# EAGLE design cbm_usb_v1.1a (EAGLE 6.4)

## Sheet 1 of 3
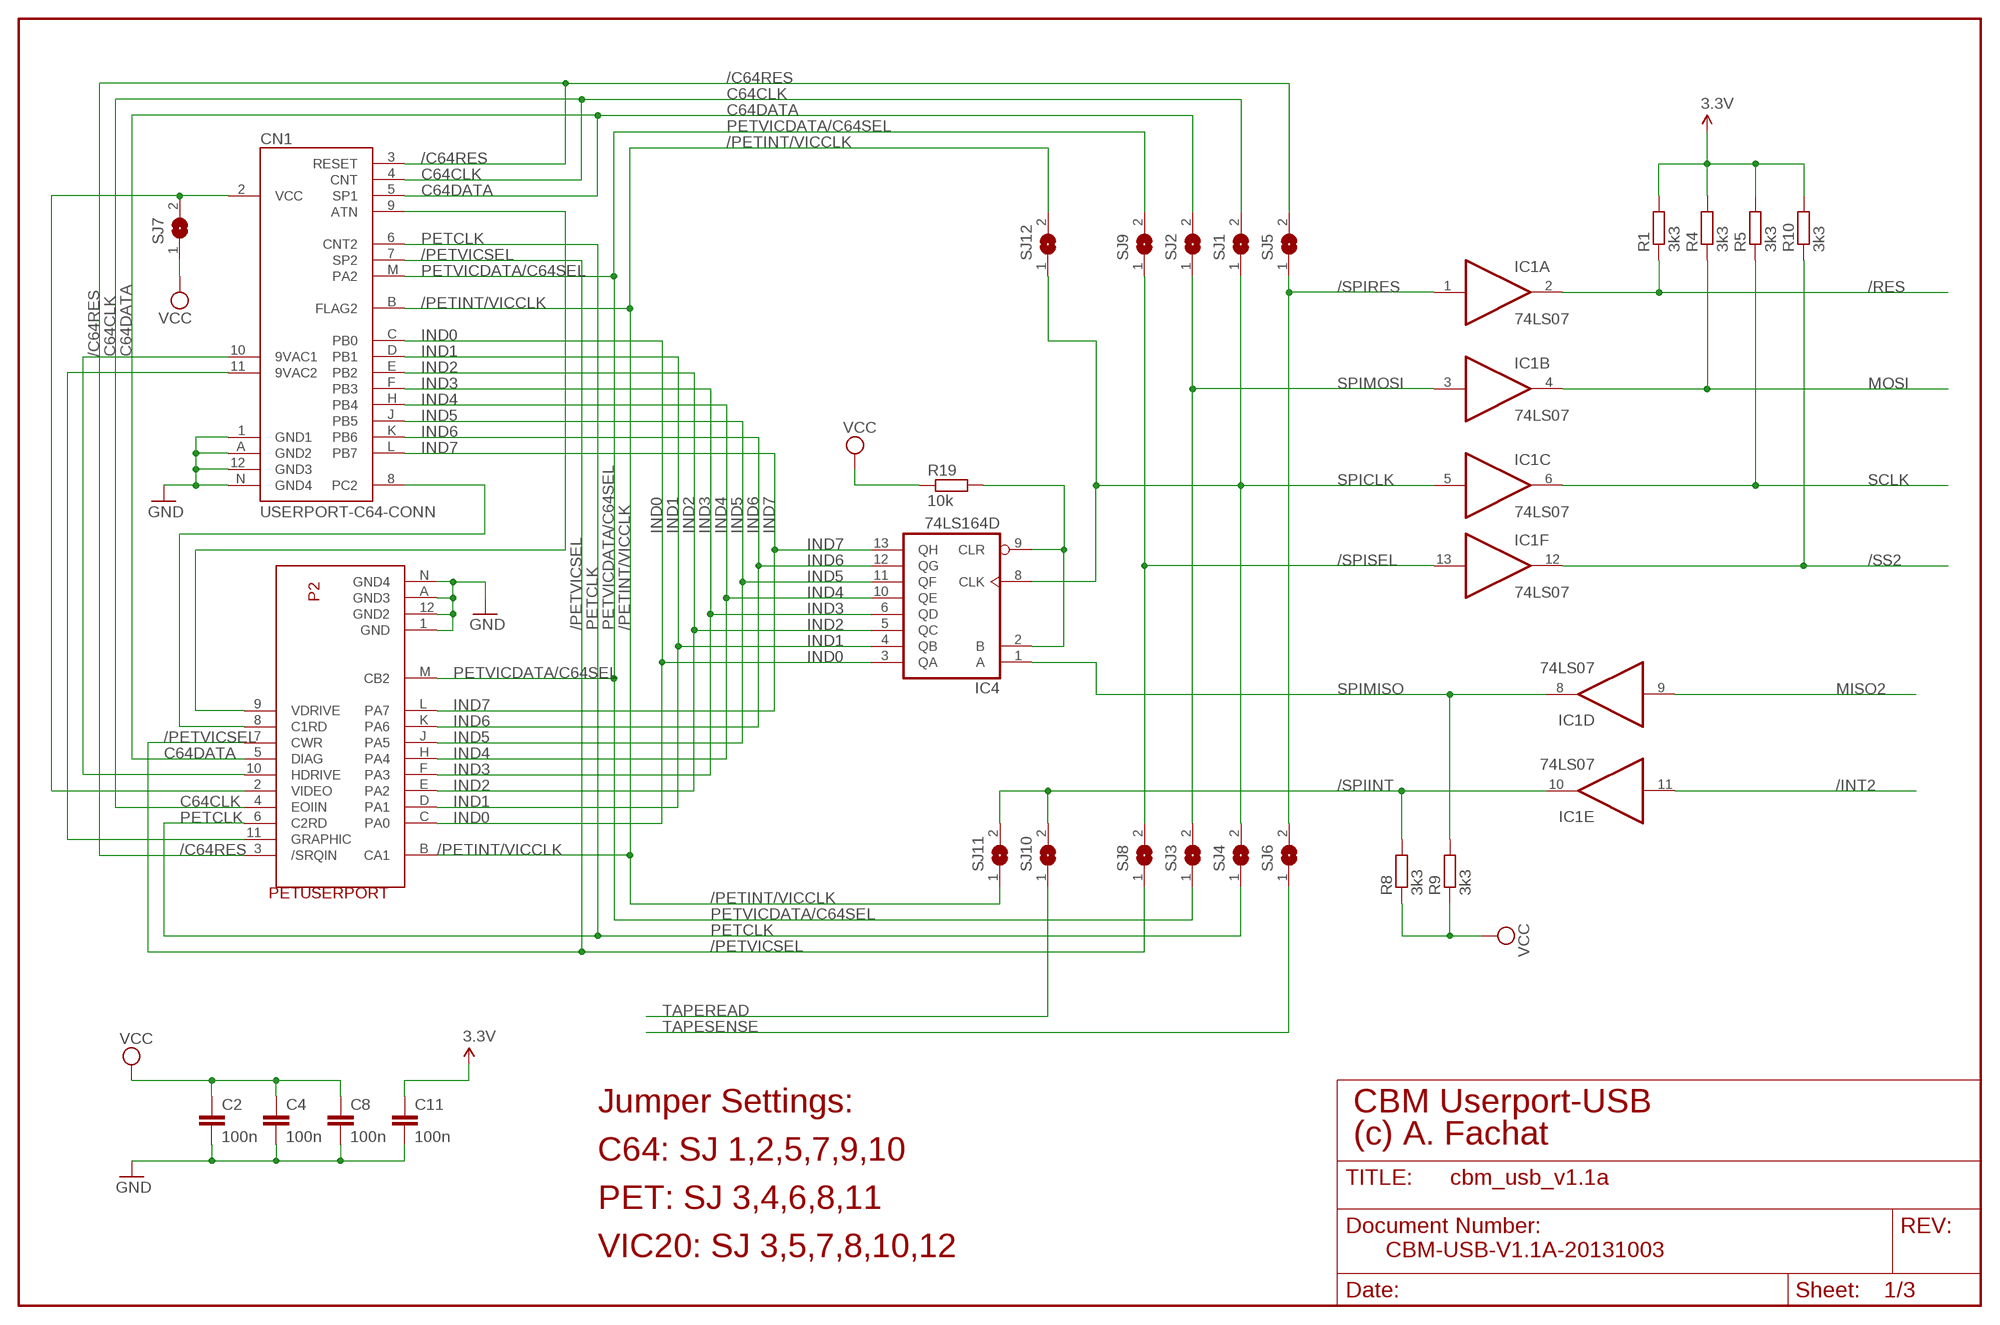
[diagram p0: schematic, sheet 1]

### Parts
C2  100n  C-EU050-025X075  [C050-025X075]
C4  100n  C-EU050-025X075  [C050-025X075]
C8  100n  C-EU050-025X075  [C050-025X075]
C11  100n  C-EU050-025X075  [C050-025X075]
CN1  USERPORT-C64-CONN  [UPS24CONN]
IC1  74LS07  74LS07D  [SO14]
IC4  74LS164D  [SO14]
P2  PETUSERPORT  [FLAT24]
R1  3k3  R-EU_0204/7  [0204/7]
R4  3k3  R-EU_0204/7  [0204/7]
R5  3k3  R-EU_0204/7  [0204/7]
R8  3k3  R-EU_0204/7  [0204/7]
R9  3k3  R-EU_0204/7  [0204/7]
R10  3k3  R-EU_0204/7  [0204/7]
R19  10k  R-EU_0204/7  [0204/7]
SJ1  SJW  [SJW]
SJ2  SJW  [SJW]
SJ3  SJW  [SJW]
SJ4  SJW  [SJW]
SJ5  SJW  [SJW]
SJ6  SJW  [SJW]
SJ7  SJW  [SJW]
SJ8  SJW  [SJW]
SJ9  SJW  [SJW]
SJ10  SJW  [SJW]
SJ11  SJW  [SJW]
SJ12  SJW  [SJW]

### Nets
3.3V: C11.1 R1.2 R4.2 R5.2 R10.2 ; also sheet 2,3
/C64RES: CN1.3(RESET) P2.3(/SRQIN) SJ5.2
/INT2: IC1.11(E:I) ; also sheet 2
/PETINT/VICCLK: CN1.B(FLAG2) P2.B(CA1) SJ11.1 SJ12.2
/PETVICSEL: CN1.7(SP2) P2.7(CWR) SJ8.1
/RES: IC1.2(A:O) R1.1 ; also sheet 2
/SPIINT: IC1.10(E:O) R8.2 SJ10.2 SJ11.2
/SPIRES: IC1.1(A:I) SJ5.1 SJ6.2
/SPISEL: IC1.13(F:I) SJ8.2 SJ9.1
/SS2: IC1.12(F:O) R10.1 ; also sheet 2
C64CLK: CN1.4(CNT) P2.4(EOIIN) SJ1.2
C64DATA: CN1.5(SP1) P2.5(DIAG) SJ2.2
GND: C2.2 C4.2 C8.2 C11.2 CN1.1(GND1) CN1.12(GND3) CN1.A(GND2) CN1.N(GND4) P2.1(GND) P2.12(GND2) P2.A(GND3) P2.N(GND4) ; also sheet 2,3
IND0: CN1.C(PB0) IC4.3(QA) P2.C(PA0)
IND1: CN1.D(PB1) IC4.4(QB) P2.D(PA1)
IND2: CN1.E(PB2) IC4.5(QC) P2.E(PA2)
IND3: CN1.F(PB3) IC4.6(QD) P2.F(PA3)
IND4: CN1.H(PB4) IC4.10(QE) P2.H(PA4)
IND5: CN1.J(PB5) IC4.11(QF) P2.J(PA5)
IND6: CN1.K(PB6) IC4.12(QG) P2.K(PA6)
IND7: CN1.L(PB7) IC4.13(QH) P2.L(PA7)
MISO2: IC1.9(D:I) ; also sheet 2
MOSI: IC1.4(B:O) R4.1 ; also sheet 2
N$1: CN1.10(9VAC1) P2.10(HDRIVE)
N$2: CN1.11(9VAC2) P2.11(GRAPHIC)
N$5: CN1.2(VCC) P2.2(VIDEO) SJ7.2
N$6: CN1.8(PC2) P2.8(C1RD)
N$7: CN1.9(ATN) P2.9(VDRIVE)
N$37: IC4.2(B) IC4.9(CLR) R19.2
PETCLK: CN1.6(CNT2) P2.6(C2RD) SJ4.1
PETVICDATA/C64SEL: CN1.M(PA2) P2.M(CB2) SJ3.1 SJ9.2
SCLK: IC1.6(C:O) R5.1 ; also sheet 2
SPICLK: IC1.5(C:I) IC4.8(CLK) SJ1.1 SJ4.2 SJ12.1
SPIMISO: IC1.8(D:O) IC4.1(A) R9.2
SPIMOSI: IC1.3(B:I) SJ2.1 SJ3.2
TAPEREAD: SJ10.1 ; also sheet 3
TAPESENSE: SJ6.1 ; also sheet 3
VCC: C2.1 C4.1 C8.1 R8.1 R9.1 R19.1 SJ7.1 ; also sheet 2,3

### Notes on the sheet
- Jumper Settings: | CBM Userport-USB
- (c) A. Fachat
- C64: SJ 1,2,5,7,9,10
- PET: SJ 3,4,6,8,11
- VIC20: SJ 3,5,7,8,10,12 | CBM-USB-V1.1A-20131003

## Sheet 2 of 3
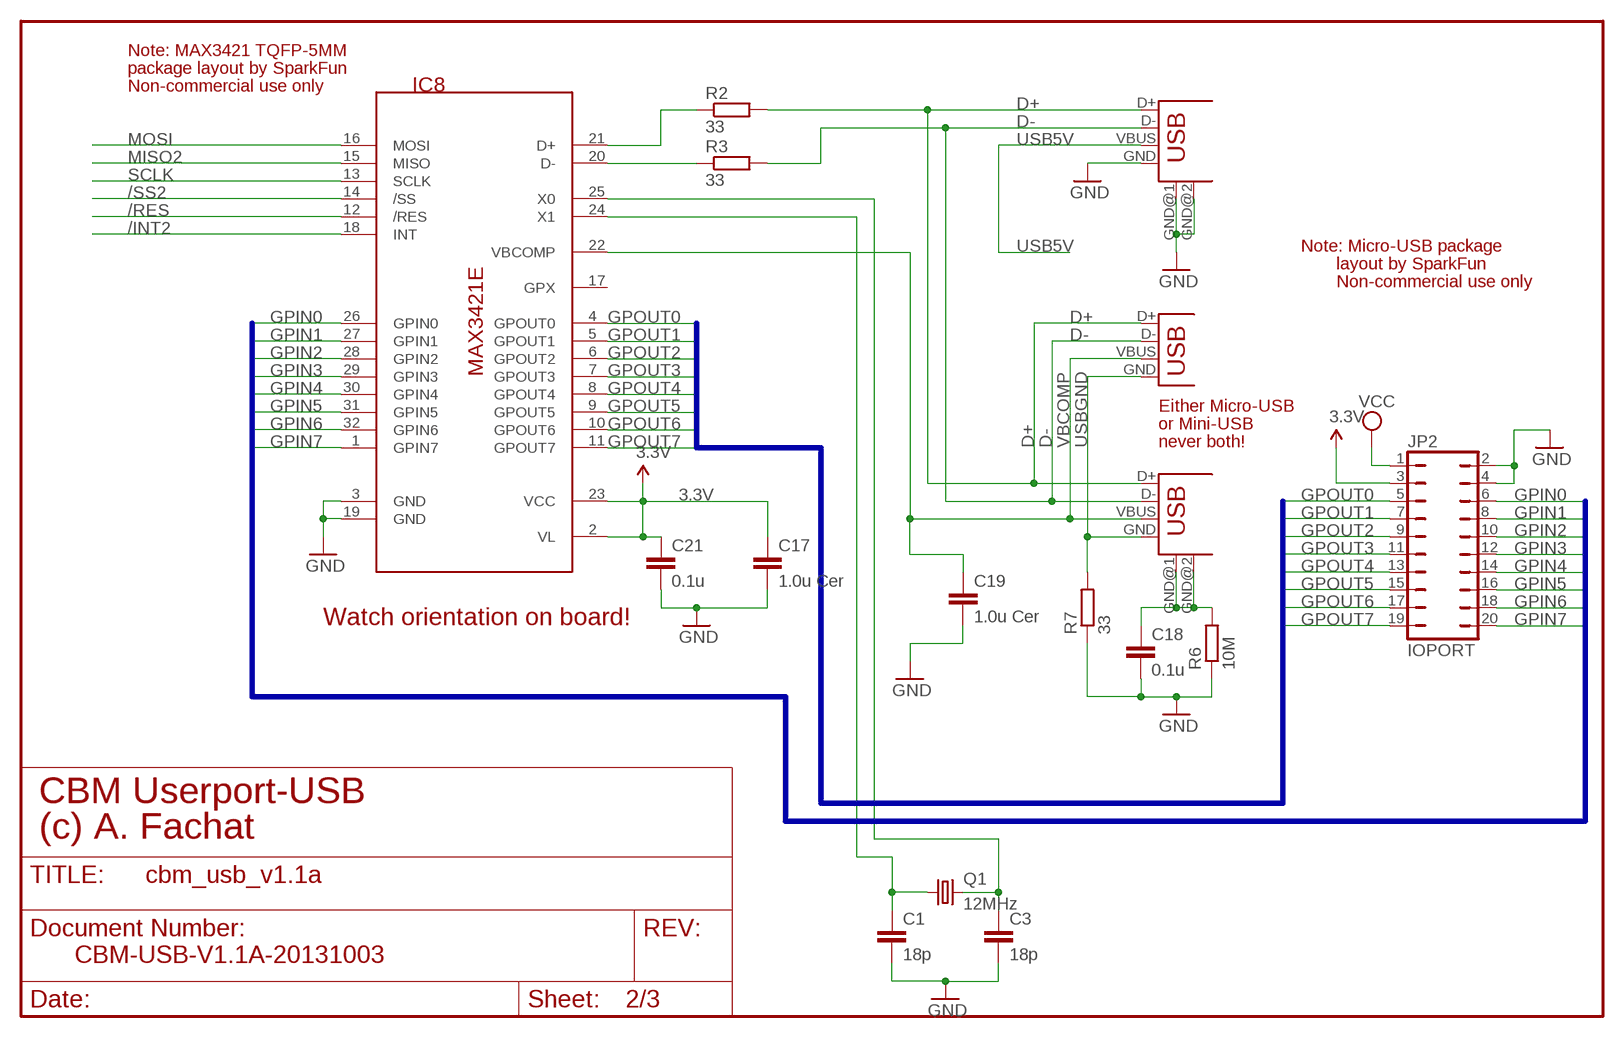
[diagram p1: schematic, sheet 2]

### Parts
C1  18p  C-EU050-025X075  [C050-025X075]
C3  18p  C-EU050-025X075  [C050-025X075]
C17  1.0u Cer  C-EU050-024X044  [C050-024X044]
C18  0.1u  C-EU050-025X075  [C050-025X075]
C19  1.0u Cer  C-EU050-024X044  [C050-024X044]
C21  0.1u  C-EU050-025X075  [C050-025X075]
IC8  MAX3421E  [TQFP32-5MM]
JP2  IOPORT  JP10Q  [JP10Q]
Q1  12MHz  CRYSTALHC49U70  [HC49U70]
R2  33  R-EU_0204/7  [0204/7]
R3  33  R-EU_0204/7  [0204/7]
R6  10M  R-EU_0204/7  [0204/7]
R7  33  R-EU_0204/7  [0204/7]
USB1  USB-A-H  [USB-A-H]
USB2  USB-MB-H  [USB-MB-H]
X1  USB-MICROB  [USB-MICROB]

### Nets
3.3V: C17.1 C21.1 IC8.2(VL) IC8.23(VCC) JP2.3 ; also sheet 1,3
12MHZ: C1.1 IC8.24(X1) Q1.1
/INT2: IC8.18(INT) ; also sheet 1
/RES: IC8.12(/RES) ; also sheet 1
/SS2: IC8.14(/SS) ; also sheet 1
D+: R2.2 USB1.D+ USB2.D+ X1.D+
D-: R3.2 USB1.D- USB2.D- X1.D-
GND: C1.2 C3.2 C17.2 C18.2 C19.2 C21.2 IC8.3(GND) IC8.19(GND) JP2.2 JP2.4 R6.1 R7.1 USB1.GND USB1.GND@1(GND) USB1.GND@2(GND) ; also sheet 1,3
GPIN0: IC8.26(GPIN0) JP2.6
GPIN1: IC8.27(GPIN1) JP2.8
GPIN2: IC8.28(GPIN2) JP2.10
GPIN3: IC8.29(GPIN3) JP2.12
GPIN4: IC8.30(GPIN4) JP2.14
GPIN5: IC8.31(GPIN5) JP2.16
GPIN6: IC8.32(GPIN6) JP2.18
GPIN7: IC8.1(GPIN7) JP2.20
GPOUT0: IC8.4(GPOUT0) JP2.5
GPOUT1: IC8.5(GPOUT1) JP2.7
GPOUT2: IC8.6(GPOUT2) JP2.9
GPOUT3: IC8.7(GPOUT3) JP2.11
GPOUT4: IC8.8(GPOUT4) JP2.13
GPOUT5: IC8.9(GPOUT5) JP2.15
GPOUT6: IC8.10(GPOUT6) JP2.17
GPOUT7: IC8.11(GPOUT7) JP2.19
MISO2: IC8.15(MISO) ; also sheet 1
MOSI: IC8.16(MOSI) ; also sheet 1
N$3: IC8.20(D-) R3.1
N$4: IC8.21(D+) R2.1
N$11: C3.1 IC8.25(X0) Q1.2
N$16: C18.1 R6.2 USB2.GND@1(GND) USB2.GND@2(GND)
SCLK: IC8.13(SCLK) ; also sheet 1
USB5V: USB1.VBUS ; also sheet 3
USBGND: R7.2 USB2.GND X1.GND
VBCOMP: C19.1 IC8.22(VBCOMP) USB2.VBUS X1.VBUS
VCC: JP2.1 ; also sheet 1,3
Unconnected: IC8.17(GPX)

### Buses
GPIN[0..7]
GPOUT[0..7]

### Notes on the sheet
- Note: MAX3421 TQFP-5MM
- package layout by SparkFun
- Non-commercial use only
- Note: Micro-USB package
- layout by SparkFun
- Non-commercial use only
- Either Micro-USB
- or Mini-USB
- never both!
- Watch orientation on board!
- CBM Userport-USB
- (c) A. Fachat
- CBM-USB-V1.1A-20131003

## Sheet 3 of 3
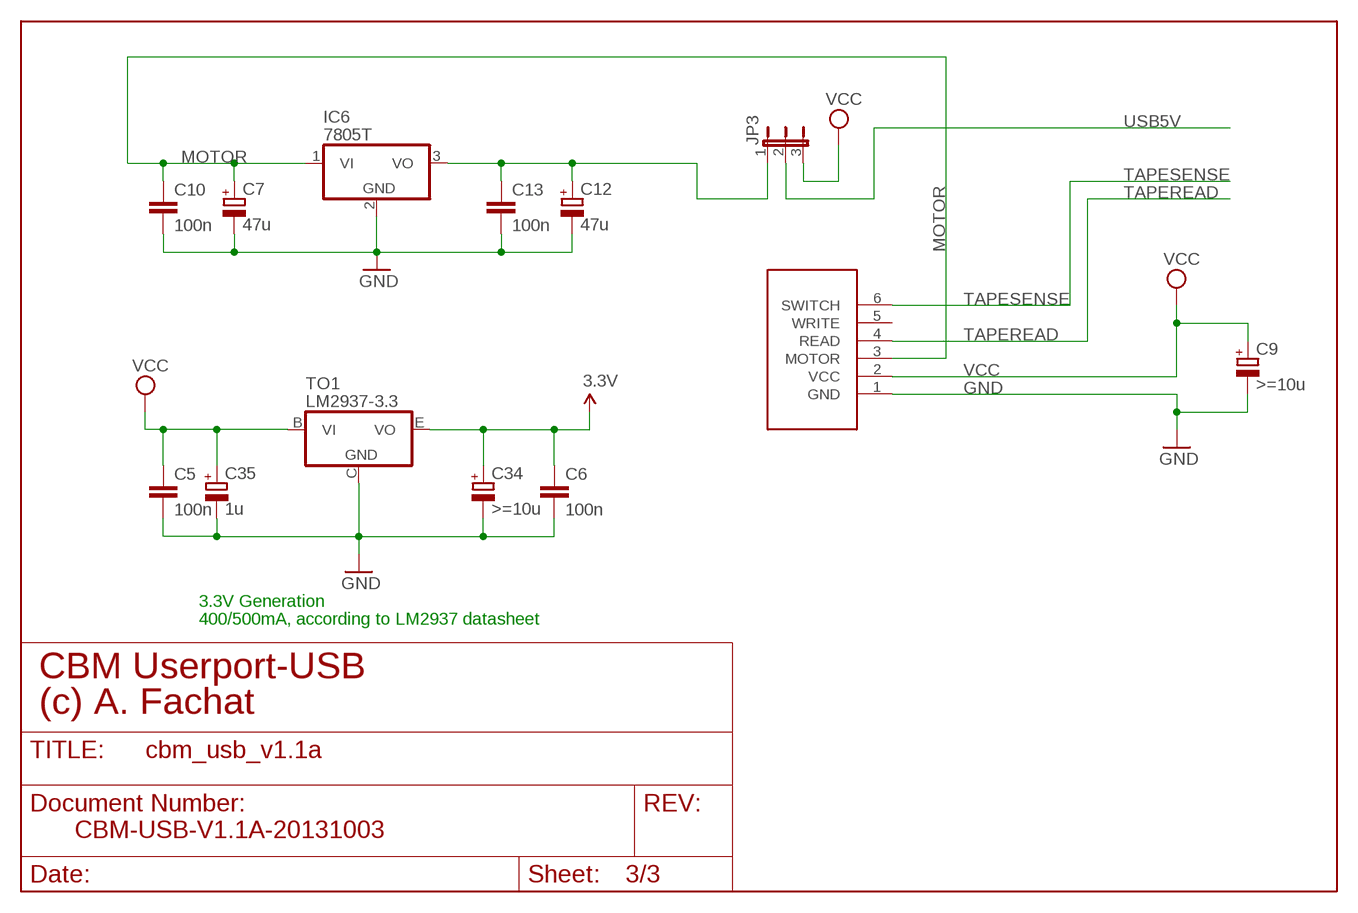
[diagram p2: schematic, sheet 3]

### Parts
C5  100n  C-EU050-025X075  [C050-025X075]
C6  100n  C-EU050-025X075  [C050-025X075]
C7  47u  CPOL-EUE3.5-8  [E3,5-8]
C9  >=10u  CPOL-EUE5-10.5  [E5-10,5]
C10  100n  C-EU050-030X075  [C050-030X075]
C12  47u  CPOL-EUE3.5-8  [E3,5-8]
C13  100n  C-EU050-030X075  [C050-030X075]
C34  >=10u  CPOL-EUE5-8.5  [E5-8,5]
C35  1u  CPOL-EUE5-8.5  [E5-8,5]
IC6  7805T  [TO220H]
JP3  JP2E  [JP2]
P3  CBMTAPE  [JP6]
TO1  LM2937-3.3  LM2937  [TO220H]

### Nets
3.3V: C6.1 C34.+ TO1.E(VO) ; also sheet 1,2
GND: C5.2 C6.2 C7.- C9.- C10.2 C12.- C13.2 C34.- C35.- IC6.2(GND) P3.1(GND) TO1.C(GND) ; also sheet 1,2
MOTOR: C7.+ C10.1 IC6.1(VI) P3.3(MOTOR)
N$8: C12.+ C13.1 IC6.3(VO) JP3.1
TAPEREAD: P3.4(READ) ; also sheet 1
TAPESENSE: P3.6(SWITCH) ; also sheet 1
USB5V: JP3.2 ; also sheet 2
VCC: C5.1 C9.+ C35.+ JP3.3 P3.2(VCC) TO1.B(VI) ; also sheet 1,2
Unconnected: P3.5(WRITE)

### Notes on the sheet
- 3.3V Generation
- 400/500mA, according to LM2937 datasheet
- CBM Userport-USB
- (c) A. Fachat
- CBM-USB-V1.1A-20131003

## Power pins joined to a net without a drawn wire
GND: IC1.7(P:GND) IC4.7(GND)
VCC: IC1.14(P:VCC) IC4.14(VCC)

## Library data of the parts
C1-C6 C8 C10 C11 C13 C17-C19 C21 = rcl:C-EU: CAPACITOR, European symbol
C7 C9 C12 C34 C35 = rcl:CPOL-EU: POLARIZED CAPACITOR, European symbol
CN1 = 0RB_Commodore:USERPORT-C64-CONN
IC1 = 74xx-eu:74*07: Hex BUFFER, open collector high-voltage output
IC4 = 74xx-eu:74*164: 8-bit parallel out SHIFT REGISTER
IC6 = linear:78*: Positive VOLTAGE REGULATOR Source: http://cache.national.com/ds/LM/LM78L05.pdf http://www.fairchildsemi.com/ds/LM/LM7805.pdf
IC8 = csa:MAX3421E
JP2 = jumper:JP10Q: JUMPER
JP3 = jumper:JP2E: JUMPER
P2 = csa:PETUSERPORT
P3 = csa:CBMTAPE
Q1 = crystal:CRYSTAL: CRYSTAL; OC_FARNELL: unknown; OC_NEWARK: unknown
R1-R10 R19 = rcl:R-EU_: RESISTOR, European symbol
SJ1-SJ12 = jumper:SJ: SMD solder JUMPER
TO1 = csa:LM2937
USB1 USB2 = con-usb-2:USB: USB Connectors USB-B-PTH is fully proven SKU : PRT-00139 USB-miniB is fully proven SKU : PRT-00587 USB-A-PCB is untested. USB-A-H is throughly reviewed, but untested. Spark Fun Electronics SKU : PRT-00437 USB-B-SMT is throughly reviewed, but untested. Needs silkscreen touching up. USB-A-S has not been used/tested USB-MB-H has not been used/tested
X1 = SparkFun:USB: USB Connectors USB-B-PTH is fully proven SKU : PRT-00139 USB-miniB is fully proven SKU : PRT-00587 USB-A-PCB is untested. USB-A-H is throughly reviewed, but untested. Spark Fun Electronics SKU : PRT-00437 USB-B-SMT is throughly reviewed, but untested. Needs silkscreen touching up. USB-A-S has not been used/tested USB-MB-H has not been used/tested

## Board
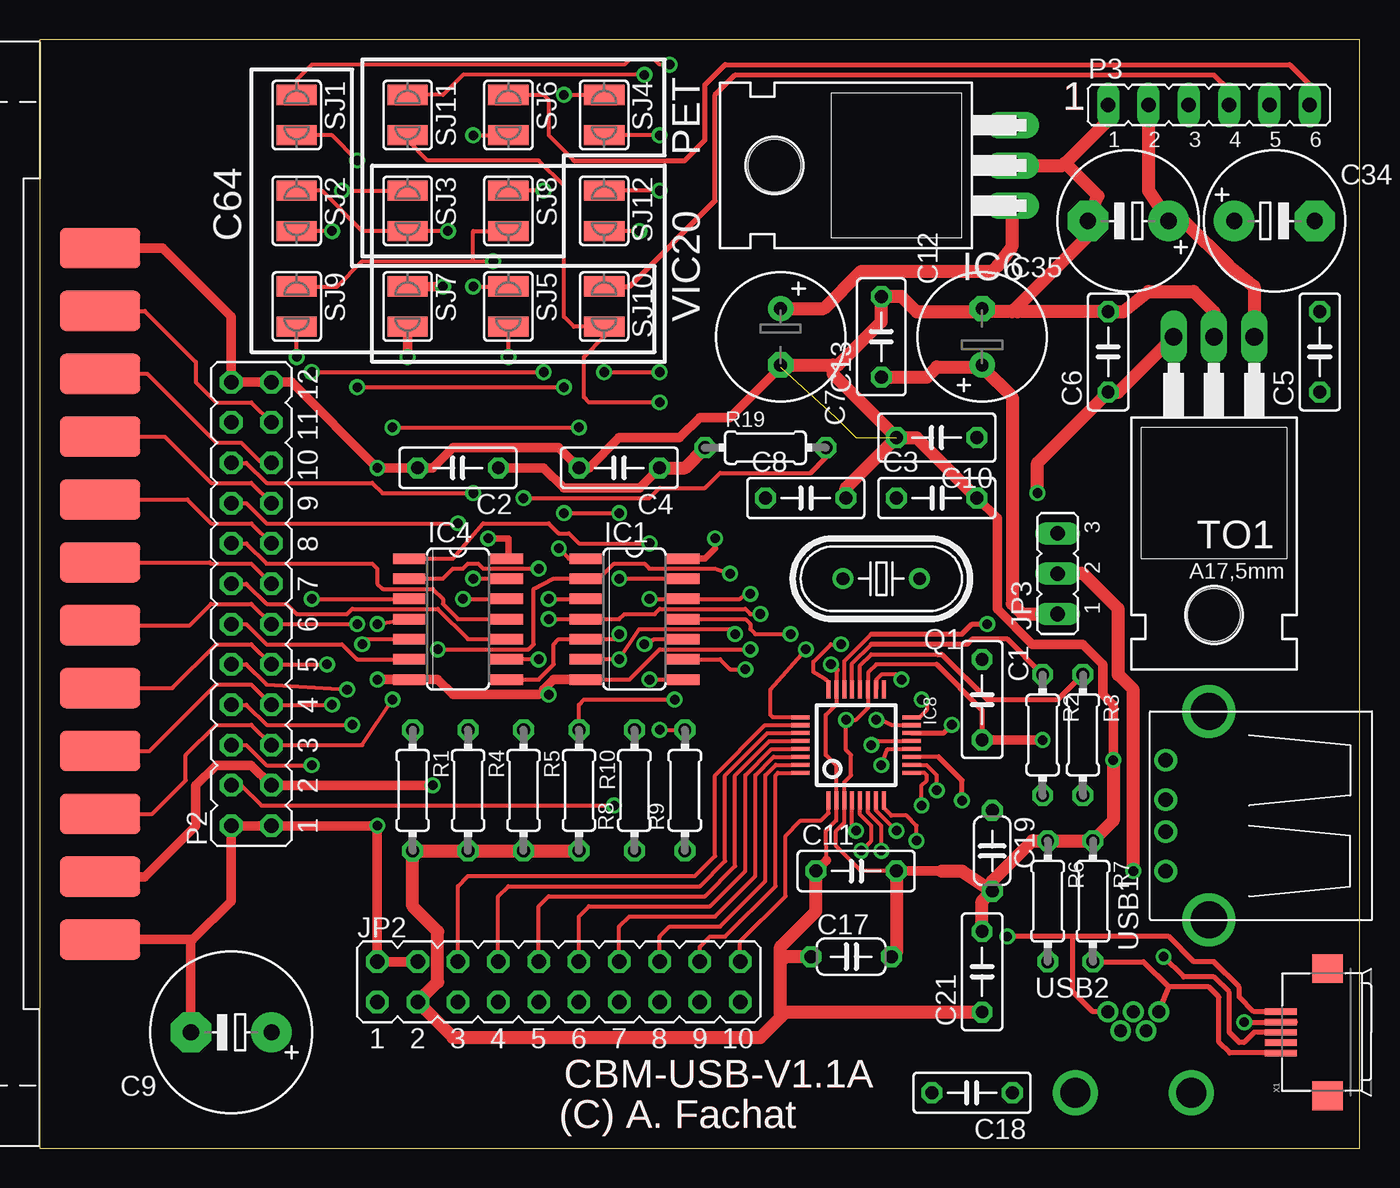
[diagram p3: board, top side]
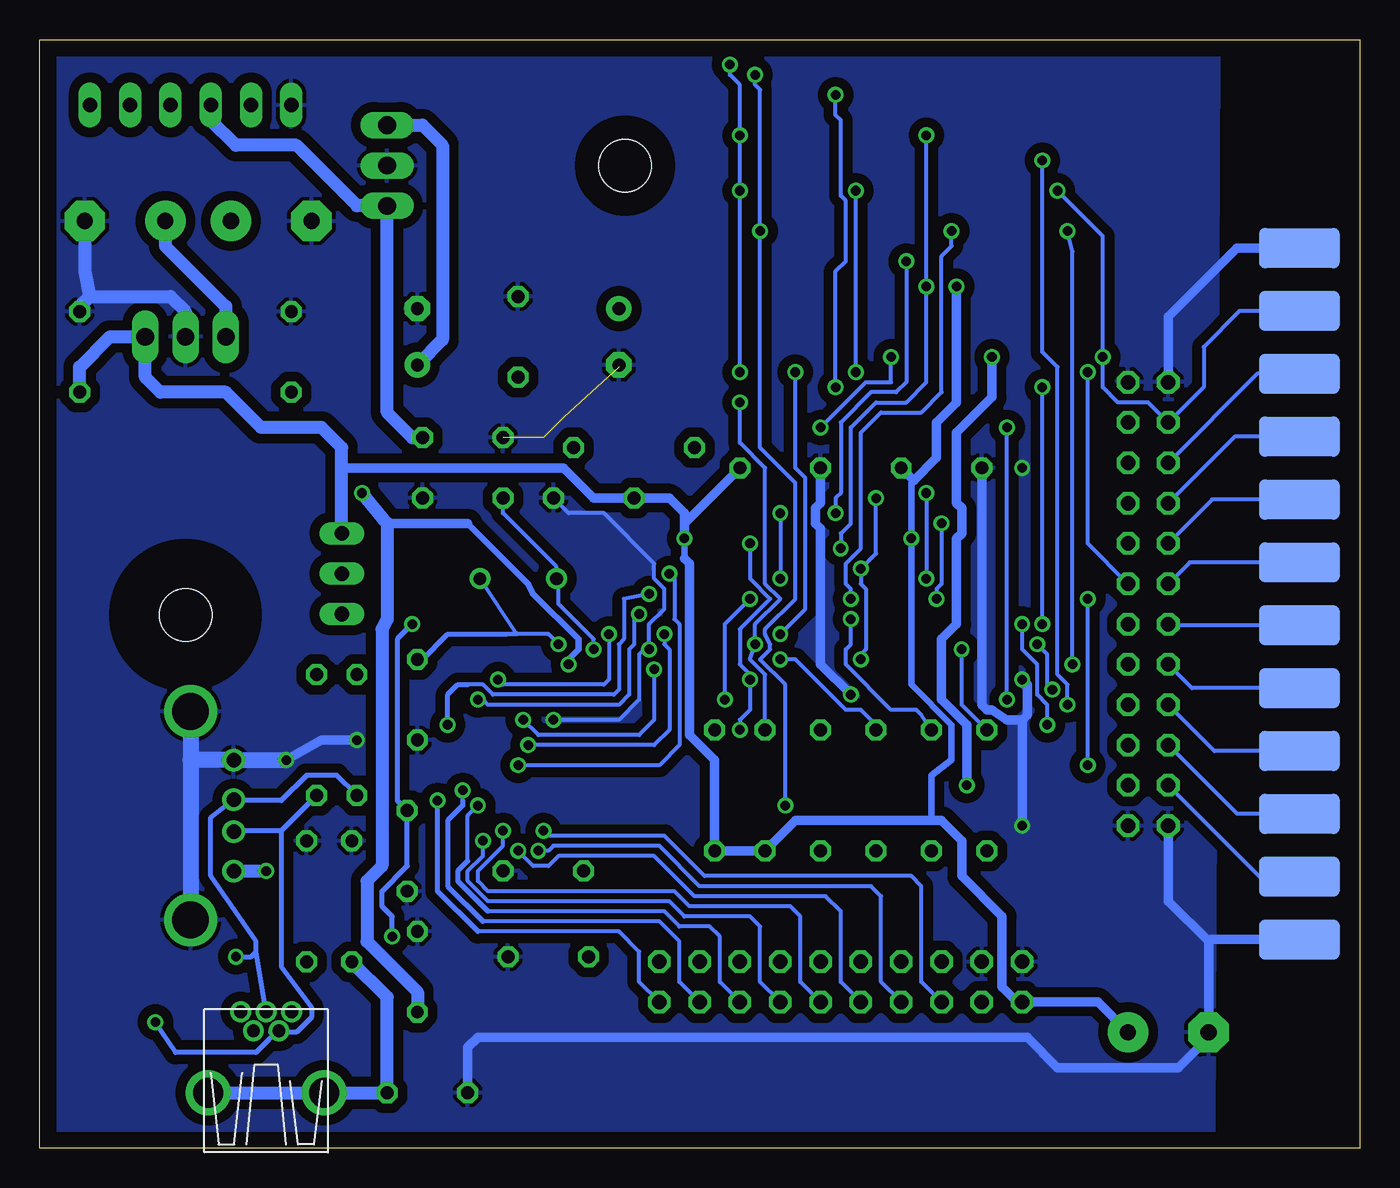
[diagram p4: board, bottom side, seen from below]

Size 83.17 x 69.84 mm. Coordinates in mm from the lower left corner, seen from the top.
Outline: 0,0 83.17,0 83.17,69.84 0,69.84 0,0
Copper layers (1*16): Top 0.035mm / dielectric 1.5mm / Bottom 0.035mm
Design rules "default *": minimum track width 10mil, minimum drill 12mil, track to track 6mil, track to pad 6mil, pad to pad 6mil, via to via 6mil, smd to smd 6mil, copper to edge 40mil, drill to drill 8mil, minimum pad ring 10mil, minimum via ring 8mil, stop-mask expansion 4mil, vias tented up to drill 0mil, thermal gap 10mil

### Footprints (pad centres in the part's own frame; a part is rotated, then mirrored left to right if it is on the bottom)
C050-025X075 = drill 0.813 octagon: 1 -2.54,0; 2 2.54,0
E3,5-8 = drill 0.813 pad 1.6: + -1.778,0 | drill 0.813 pad 1.6 octagon: - 1.778,0
E5-10,5 = drill 1.016 pad 2.54: + -2.54,0 | drill 1.016 pad 2.54 octagon: - 2.54,0
C050-030X075 = drill 0.813 octagon: 1 -2.54,0; 2 2.54,0
C050-024X044 = drill 0.813 octagon: 1 -2.54,0; 2 2.54,0
E5-8,5 = drill 1.016 pad 2.54: + -2.54,0 | drill 1.016 pad 2.54 octagon: - 2.54,0
UPS24CONN = smd 2.54 x 5.08: 1 -21.779,-1.27; 2 -17.819,-1.27; 3 -13.859,-1.27; 4 -9.899,-1.27; 5 -5.939,-1.27; 6 -1.979,-1.27; 7 1.981,-1.27; 8 5.941,-1.27; 9 9.901,-1.27; 10 13.861,-1.27; 11 17.821,-1.27; 12 21.781,-1.27 | smd 2.54 x 5.08 bottom: A -21.779,-1.27; B -17.819,-1.27; C -13.859,-1.27; D -9.899,-1.27; E -5.939,-1.27; F -1.979,-1.27; H 1.981,-1.27; J 5.941,-1.27; K 9.901,-1.27; L 13.861,-1.27; M 17.821,-1.27; N 21.781,-1.27
SO14 = smd 0.66 x 2.032: 1 -3.81,-3.073; 2 -2.54,-3.073; 3 -1.27,-3.073; 4 0,-3.073; 5 1.27,-3.073; 6 2.54,-3.073; 7 3.81,-3.073; 8 3.81,3.073; 9 2.54,3.073; 10 1.27,3.073; 11 0,3.073; 12 -1.27,3.073; 13 -2.54,3.073; 14 -3.81,3.073
TO220H = drill 1.118 long: 1 -2.54,-10.16; 2 0,-10.16; 3 2.54,-10.16 | hole 3.302: 0,4.826
TQFP32-5MM = smd 1.143 x 0.254: 1 -3.5,1.75; 2 -3.5,1.25; 3 -3.5,0.75; 4 -3.5,0.25; 5 -3.5,-0.25; 6 -3.5,-0.75; 7 -3.5,-1.25; 8 -3.5,-1.75; 17 3.5,-1.75; 18 3.5,-1.25; 19 3.5,-0.75; 20 3.5,-0.25; 21 3.5,0.25; 22 3.5,0.75; 23 3.5,1.25; 24 3.5,1.75 | smd 0.254 x 1.143: 9 -1.75,-3.5; 10 -1.25,-3.5; 11 -0.75,-3.5; 12 -0.25,-3.5; 13 0.25,-3.5; 14 0.75,-3.5; 15 1.25,-3.5; 16 1.75,-3.5; 25 1.75,3.5; 26 1.25,3.5; 27 0.75,3.5; 28 0.25,3.5; 29 -0.25,3.5; 30 -0.75,3.5; 31 -1.25,3.5; 32 -1.75,3.5
JP10Q = drill 0.914 octagon: 1 -11.43,-1.27; 2 -11.43,1.27; 3 -8.89,-1.27; 4 -8.89,1.27; 5 -6.35,-1.27; 6 -6.35,1.27; 7 -3.81,-1.27; 8 -3.81,1.27; 9 -1.27,-1.27; 10 -1.27,1.27; 11 1.27,-1.27; 12 1.27,1.27; 13 3.81,-1.27; 14 3.81,1.27; 15 6.35,-1.27; 16 6.35,1.27; 17 8.89,-1.27; 18 8.89,1.27; 19 11.43,-1.27; 20 11.43,1.27
JP2 = drill 0.914 long: 1 -2.54,0; 2 0,0; 3 2.54,0
FLAT24 = drill 0.914 octagon: 1 -13.97,-1.27; 2 -11.43,-1.27; 3 -8.89,-1.27; 4 -6.35,-1.27; 5 -3.81,-1.27; 6 -1.27,-1.27; 7 1.27,-1.27; 8 3.81,-1.27; 9 6.35,-1.27; 10 8.89,-1.27; 11 11.43,-1.27; 12 13.97,-1.27; A -13.97,1.27; B -11.43,1.27; C -8.89,1.27; D -6.35,1.27; E -3.81,1.27; F -1.27,1.27; H 1.27,1.27; J 3.81,1.27; K 6.35,1.27; L 8.89,1.27; M 11.43,1.27; N 13.97,1.27
JP6 = drill 0.914 long: 1 -7.62,1.27; 2 -5.08,1.27; 3 -2.54,1.27; 4 0,1.27; 5 2.54,1.27; 6 5.08,1.27
HC49U70 = drill 0.813: 1 -2.413,0; 2 2.413,0
0204/7 = drill 0.813 octagon: 1 -3.81,0; 2 3.81,0
SJW = smd 1.27 x 2.54: 1 -1.27,0; 2 1.27,0
TO220H' = drill 1.118 long: B -2.54,-10.16; C 0,-10.16; E 2.54,-10.16 | hole 3.302: 0,7.366
USB-A-H = drill 0.914: D+ 2.718,-1.003; D- 2.718,1.003; GND 2.718,-3.493; VBUS 2.718,3.493 | drill 2.311: GND@1 0,6.566; GND@2 0,-6.566
USB-MB-H = drill 0.8: D+ 5.1,0; D- 3.9,0.8; GND 5.1,-1.6; ID 3.9,-0.8; VBUS 5.1,1.6 | drill 1.9: GND@1 0,3.65; GND@2 0,-3.65
USB-MICROB = smd 0.4 x 2: D+ 0,3.1; D- 0.65,3.1; GND -1.3,3.1; ID -0.65,3.1; VBUS 1.3,3.1 | smd 1.8 x 1.9: GND@2 -4,0.15; GND@3 4,0.15

### Placement (x,y rotation side)
C1  59.37,28.26 270 top
C2  26.35,42.86 180 top
C3  56.52,40.96 0 top
C4  36.51,42.86 180 top
C5  80.65,50.17 90 top
C6  67.31,50.17 90 top
C7  46.67,51.12 270 top
C8  48.26,40.96 0 top
C9  12.06,7.3 180 top
C10  56.52,44.77 180 top
C11  51.43,17.46 0 top
C12  59.37,51.12 90 top
C13  53.02,51.12 90 top
C17  51.12,12.07 0 top
C18  58.74,3.49 180 top
C19  60.01,18.73 270 top
C21  59.37,11.11 90 top
C34  77.79,58.42 0 top
C35  68.58,58.42 180 top
CN1  2.54,34.92 90 top
IC1  37.46,33.34 270 top
IC4  26.35,33.34 270 top
IC6  51.12,61.91 90 top
IC8  51.43,25.4 90 top
JP2  32.7,10.48 0 top
JP3  64.14,36.2 90 top
P2  13.33,34.29 90 top
P3  74.93,64.45 0 top
Q1  53.02,35.88 180 top
R1  23.5,22.54 270 top
R2  63.18,26.04 270 top
R3  65.72,26.04 270 top
R4  26.99,22.54 270 top
R5  30.48,22.54 270 top
R6  63.5,15.56 270 top
R7  66.36,15.56 270 top
R8  37.46,22.54 90 top
R9  40.64,22.54 90 top
R10  33.97,22.54 270 top
R19  45.72,44.13 0 top
SJ1  16.19,65.09 270 top
SJ2  16.19,59.06 270 top
SJ3  23.18,59.06 270 top
SJ4  35.56,65.09 270 top
SJ5  29.53,53.02 270 top
SJ6  29.53,65.09 270 top
SJ7  23.18,53.02 270 top
SJ8  29.53,59.06 270 top
SJ9  16.19,53.02 270 top
SJ10  35.56,53.02 270 top
SJ11  23.18,65.09 270 top
SJ12  35.56,59.06 270 top
TO1  LM2937-3.3  [TO220H']  73.98,40.96 180 top
USB1  73.66,20.96 180 top
USB2  68.9,3.49 90 top
X1  81.28,7.3 90 top

### Tracks (layer width: path | path; a pad name or v marks a point on that pad's centre or on a via)
3.3V  (via drill 0.6)
  Top 0.254: 49.55,18.12 49.53,20 50.17,20.64 50.18,20.64 IC8.2 50.18,24.13 | 50.18,24.13 49.85,24.45 49.53,24.77 49.53,27.31 50.18,27.96 IC8.23 50.18,30.14 | 50.18,24.13 50.17,24.13
  Top 0.406: v49.85,30.48 50.18,30.14
  Top 0.61: C11.1 49.55,18.12
  Top 0.813: R10.2 R5.2 R4.2 R1.2 23.49,15.24 25.08,13.65 25.08,10.48 JP2.3 26.03,6.98 45.4,6.98 46.67,8.26 | C11.1 48.89,14.92 46.67,12.7 46.67,11.75 | 46.67,8.26 46.67,11.75 | TO1.E 67.95,47.63 C6.1 62.86,43.18 v62.86,41.28 | C21.1 46.99,8.57 46.67,8.26 | C17.1 46.99,12.07 46.67,11.75
  Bottom 0.254: v49.85,30.48 49.85,30.8
  Bottom 0.406: 49.85,30.8 49.21,31.43 49.21,32.07 52.07,34.92 52.39,35.56 56.2,39.37
  Bottom 0.61: 56.2,39.37 61.28,39.37
  Bottom 0.813: C34.+ 75.25,56.83 71.44,53.02 TO1.E | v62.86,41.28 61.28,39.37 61.28,33.34 61.6,32.7 61.6,17.78 62.55,16.83 62.55,13.02 59.37,9.84 C21.1
12MHZ  (via drill 0.6)
  Top 0.254: IC8.24 49.68,29.37 49.53,29.53 48.73,30.01 48.73,30.64 49.85,31.75 v50.48,31.75
  Bottom 0.254: v50.48,31.75 51.12,32.39 53.21,32.39 53.12,32.41 Q1.1 55.44,36.39
  Bottom 0.305: C1.1 59.06,30.8 57.47,32.39 53.78,32.39 53.12,32.41
/C64RES  (via drill 0.6)
  Top 0.254: CN1.3 7.1,21.07 9.21,23.18 9.21,24.77 11.11,26.67 13.33,26.67 P2.3 20.32,25.4 v22.23,28.26 | v22.23,45.4 v33.97,45.4 | v29.53,49.85 SJ5.2
  Bottom 0.254: v22.23,28.26 v22.23,45.4 | v33.97,45.4 31.12,48.26 29.53,48.26 v29.53,49.85
/INT2  (via drill 0.6)
  Top 0.254: IC1.11 44.45,33.34 44.77,33.02 44.77,32.7 45.09,32.39 v47.31,32.39 | v54.29,29.53 53.97,29.85 53.02,29.85 52.71,29.53 52.71,28.92 IC8.18
  Bottom 0.254: v47.31,32.39 47.31,29.53 47.63,29.21 53.97,29.21 v54.29,29.53
/PETINT/VICCLK  (via drill 0.6)
  Top 0.254: SJ11.1 25.4,66.36 26.67,67.63 v38.1,67.63 | P2.B 12.7,22.86 13.97,21.59 v36.2,21.59 | v37.78,57.79 SJ12.2
  Bottom 0.254: CN1.B 6.31,17.11 P2.B | v36.2,21.59 36.2,29.21 37.78,30.8 37.15,31.43 37.15,31.75 37.46,32.39 37.46,32.7 35.56,34.61 35.56,41.91 37.78,44.13 v37.78,57.79 37.78,66.68 38.1,66.99 v38.1,67.63
/PETVICSEL  (via drill 0.6)
  Top 0.254: CN1.7 10.72,36.91 10.8,36.83 13.33,36.83 P2.7 | v31.75,60.32 SJ8.1 | v17.14,48.9 v31.75,48.9
  Bottom 0.254: v31.75,48.9 v31.75,60.32 | v17.14,48.9 17.14,38.1 P2.7
/RES  (via drill 0.6)
  Top 0.254: v25.08,31.43 30.8,31.43 31.12,31.75 31.12,35.24 32.39,35.88 IC1.2 35.24,35.88 36.2,36.83 38.1,36.83 38.42,36.51 42.54,36.51 v43.5,36.2 | IC8.12 53.41,25.15 v53.02,24.13
  Bottom 0.254: v25.08,31.43 25.08,27.94 R1.1 | v53.02,24.13 44.13,24.13 42.86,25.4 42.86,33.02 43.18,33.34 43.18,35.88 v43.5,36.2
/SPIINT  (via drill 0.6)
  Top 0.254: SJ11.2 23.18,63.5 24.45,62.23 31.43,62.23 33.02,60.64 33.02,52.39 33.65,51.75 SJ10.2 35.56,51.12 34.29,49.85 34.29,47.31 34.61,46.99 v39.05,46.99 | v38.1,31.75 38.74,32.07 IC1.10
  Bottom 0.254: R8.2 37.46,29.85 38.42,30.8 v38.1,31.75 38.1,33.02 36.51,34.61 37.46,35.56 37.46,42.86 39.05,44.45 v39.05,46.99
/SPIRES  (via drill 0.6)
  Top 0.254: v27.3,63.82 SJ6.2 | v27.3,54.29 SJ5.1 | v32.7,37.78 33.34,37.15 IC1.1
  Bottom 0.254: v32.7,37.78 32.7,38.74 32.07,39.37 32.07,45.4 30.48,46.99 28.57,46.99 27.3,48.26 v27.3,54.29 v27.3,63.82
/SPISEL  (via drill 0.6)
  Top 0.254: SJ9.1 18.73,54.29 20.32,55.88 27.3,55.88 | 27.3,55.88 27.3,57.79 SJ8.2 | 27.3,55.88 v28.57,55.88 | v33.02,40 v36.51,40 | v36.51,35.88 IC1.13
  Bottom 0.254: v33.02,40 33.02,40.96 32.7,41.28 32.7,45.72 30.8,47.63 29.21,47.63 28.57,48.26 v28.57,55.88 | v36.51,40 v36.51,35.88
/SS2  (via drill 0.6)
  Top 0.254: R10.1 33.97,27.94 34.29,28.26 v40,28.26 | v38.42,34.61 IC1.12 44.13,34.61 44.45,34.92 v44.77,34.92 | 56.31,26.15 IC8.14
  Top 0.305: IC8.14 56.95,26.15 v57.47,26.67
  Bottom 0.254: v40,28.26 40,33.02 v38.42,34.61 | v44.77,34.92 46.35,34.61 46.35,32.07 46.67,31.75 46.67,28.89 46.99,28.57 54.61,28.57 55.24,29.21 56.2,29.21
  Bottom 0.305: v57.47,26.67 57.47,28.57 56.83,29.21 56.2,29.21
C64CLK  (via drill 0.6)
  Top 0.254: CN1.4 6.93,25.03 11.11,29.21 13.33,29.21 P2.4 v18.42,27.94 | SJ1.2 18.42,63.82 v20,62.23
  Bottom 0.254: v18.42,27.94 18.42,29.21 19.05,29.85 19.05,49.21 20,50.17 v20,62.23
C64DATA  (via drill 0.6)
  Top 0.254: CN1.5 8.35,28.99 11.11,31.75 13.33,31.75 P2.5 v18.1,30.48 | v18.42,57.79 SJ2.2
  Bottom 0.254: v18.42,57.79 18.1,56.51 v18.1,30.48
D+  (via drill 0.6)
  Top 0.305: X1.D+ 76.52,7.3 75.88,6.67 75.56,6.67 74.93,7.3 74.93,9.84 73.98,10.8 72.07,10.8 v70.8,12.07
  Bottom 0.305: R2.2 64.45,23.5 66.36,23.5 67.95,21.91 70.89,21.91 USB1.D+ 72.39,20.83 72.39,17.14 69.53,13.02 69.53,12.38 | USB2.D+ 69.53,12.38 | v70.8,12.07 69.85,12.07 69.53,12.38
D-  (via drill 0.6)
  Top 0.305: v75.88,7.94 79.12,7.94 X1.D-
  Bottom 0.305: R3.2 67.95,20 | 67.95,20 70.89,20 USB1.D- | 67.95,20 67.95,11.43 66.04,8.89 66.04,8.26 66.99,7.3 68.64,7.3 USB2.D- 68.73,6.83 69.53,6.03 74.61,6.03 v75.88,7.94
GND  (via drill 0.6)  (3 unrouted)
  Top 0.254: 9.52,13.02 9.65,13.15 | 31.43,28.57 31.75,28.89 | IC1.7 37.15,29.53 39.05,31.43 v44.77,31.43 | C11.2 51.75,17.46 50.17,19.05 50.17,20 50.68,20.52 IC8.3 50.68,23.06 51.12,23.5 51.12,24.77 50.8,25.08 v50.8,26.99 51.43,26.99 52.18,27.74 IC8.19 52.18,29.96 52.71,30.48 56.52,30.48
  Top 0.305: 56.52,30.48 59.37,27.62 C1.2
  Top 0.61: CN1.N 7.75,56.71 12.07,52.39 P2.N P2.12 15.87,48.26 v21.27,42.86 C2.2 24.76,42.86 26.03,44.13 32.7,44.13 C4.2 34.61,42.86 36.51,44.77 40.32,44.77 41.59,46.04 43.5,46.04 46.67,49.21 | CN1.A 9.65,13.15 12.07,15.56 P2.A P2.1 v21.27,20.32 JP2.2 JP2.4 | C9.- 9.52,13.02 | v21.27,29.53 IC4.7 25.08,29.53 26.03,28.57 31.43,28.57 | IC1.7 32.39,29.53 31.75,28.89 v32.07,28.57 | 56.83,17.46 C11.2 | C1.2 v63.18,25.72 | C3.2 60.32,39.69 60.32,33.97 62.55,31.75 65.72,31.75 66.99,30.48 66.99,28.57 67.63,27.94 v67.63,24.45
  Top 0.813: IC6.2 64.45,61.91 64.61,62.07 | 64.61,62.07 67.31,64.77 P3.1 | 64.61,62.07 66.68,60.01 C35.- 66.68,58.1 61.44,52.86 | 61.44,52.86 61.28,52.7 59.56,52.7 C12.- 59.18,52.7 55.24,52.7 54.29,53.66 C13.2 53.02,52.07 50.29,49.34 49.97,49.34 | C7.- 49.97,49.34 | 49.97,49.34 49.97,48.77 C10.2 | C8.2 50.8,41.59 C10.2 | C10.2 55.24,44.77 C3.2 | 61.44,52.86 61.6,52.7 C6.2 68.26,52.7 69.85,53.98 72.71,53.98 73.98,52.7 TO1.C | v67.63,24.45 67.63,20.64 R7.1 R6.1 62.55,19.37 60.01,16.83 C19.2 | 56.83,17.46 58.1,17.46 C19.2 | C11.2 53.97,12.38 C17.2 | C21.2 59.37,15.56 C19.2
  Bottom 0.254: CN1.N 3.94,56.83 | 9.4,13.15 9.52,13.02 | v50.8,26.99 46.67,26.99 45.4,28.26 45.4,31.11 45.09,31.43 v44.77,31.43 44.77,33.02 43.82,33.97 43.82,35.24 44.45,35.88 44.45,36.83 47.63,40 49.85,40 C8.2
  Bottom 0.61: CN1.A 9.4,13.15 | v21.27,20.32 21.27,26.99 | 21.27,26.99 20.96,27.31 20.96,29.21 v21.27,29.53 | CN1.N 7.75,56.71 12.07,52.39 P2.N | C2.2 23.81,27.94 23.49,27.62 23.18,27.62 22.23,26.99 21.27,26.99 | C4.2 33.97,40.64 34.29,40.32 34.29,39.37 33.97,39.05 33.97,30.48 v32.07,28.57 | P2.A 12.07,15.56 9.52,13.02 C9.- 9.52,6.98 11.43,5.08 19.05,5.08 20.96,6.98 55.56,6.98 56.2,6.35 C18.2 | v63.18,25.72 65.4,25.72 v67.63,24.45
  Bottom 0.813: C34.- 80.33,55.25 80.01,53.66 | 80.01,53.66 74.93,53.66 73.98,52.7 TO1.C | C5.2 80.65,53.05 80.49,53.21 80.14,53.52 80.01,53.66
  Bottom 1.016: USB1.GND@2 73.66,24.45 | 73.66,24.45 USB1.GND@1 | 73.66,24.45 USB1.GND v67.63,24.45
  pour Bottom (isolate 0.61): 8.89,68.9 82.23,68.9 82.23,0.95 9.21,0.95
GPIN0
  Top 0.254: IC8.26 45.7,26.65 42.54,23.5 42.54,18.42 41.28,17.14 26.99,17.14 26.35,16.51 JP2.6
GPIN1
  Top 0.254: IC8.27 45.84,26.15 43.18,23.5 43.18,18.1 41.59,16.51 29.53,16.51 28.89,15.88 JP2.8
GPIN2
  Top 0.254: IC8.28 45.97,25.65 43.82,23.5 43.82,17.78 41.91,15.88 32.07,15.88 31.43,15.24 JP2.10
GPIN3
  Top 0.254: IC8.29 46.1,25.15 44.45,23.5 44.45,17.46 42.23,15.24 34.61,15.24 33.97,14.6 JP2.12
GPIN4
  Top 0.254: IC8.30 46.24,24.65 45.09,23.5 45.09,17.14 42.54,14.6 37.15,14.6 36.51,13.97 JP2.14
GPIN5
  Top 0.254: IC8.31 46.38,24.15 45.72,23.5 45.72,16.83 42.86,13.97 39.69,13.97 39.05,13.33 JP2.16
GPIN6
  Top 0.254: IC8.32 46.51,23.65 46.35,23.5 46.35,16.51 43.18,13.33 42.23,13.33 41.59,12.7 JP2.18
GPIN7
  Top 0.254: JP2.20 44.13,13.02 46.99,15.88 46.99,19.68 47.94,20.64 49.21,20.64 49.69,21.11 49.68,21.11 IC8.1
GPOUT0  (via drill 0.6)
  Top 0.254: IC8.4 51.18,20.25 v51.43,20
  Bottom 0.254: JP2.5 27.62,10.48 27.62,16.51 28.26,17.14 41.28,17.14 43.82,19.68 51.12,19.68 v51.43,20
GPOUT1  (via drill 0.6)
  Top 0.254: IC8.5 51.68,21.02 52.39,20.32 52.39,19.37 v51.75,18.73
  Bottom 0.254: JP2.7 30.16,10.48 30.16,15.88 30.8,16.51 41.59,16.51 44.13,19.05 50.8,19.05 51.12,18.73 v51.75,18.73
GPOUT2  (via drill 0.6)
  Top 0.254: IC8.6 52.18,21.16 53.02,20.32 v53.02,18.73
  Bottom 0.254: JP2.9 32.7,10.48 32.7,14.92 33.65,15.88 41.91,15.88 44.45,18.42 50.48,18.42 51.12,17.78 52.07,17.78 v53.02,18.73
GPOUT3  (via drill 0.6)
  Top 0.254: IC8.7 52.68,21.29 v53.97,20
  Bottom 0.254: JP2.11 35.24,10.48 35.24,14.6 35.88,15.24 42.23,15.24 43.18,16.19 54.93,16.19 55.56,16.83 55.56,17.46 53.97,19.05 v53.97,20
GPOUT4  (via drill 0.6)
  Top 0.254: IC8.8 53.18,21.43 53.66,20.96 54.61,20.96 55.24,20.32 v55.24,19.37
  Bottom 0.254: JP2.13 37.78,10.48 37.78,13.97 38.42,14.6 42.54,14.6 43.5,15.56 54.93,15.56 56.2,16.83 56.2,17.46 55.24,18.42 v55.24,19.37
GPOUT5  (via drill 0.6)
  Top 0.254: IC8.9 55.72,23.65 55.88,23.5 55.88,23.18 55.56,22.86 v55.56,21.59
  Bottom 0.254: JP2.15 40.32,10.48 40.32,13.33 40.96,13.97 42.86,13.97 43.82,14.92 54.93,14.92 | v55.56,21.59 56.2,20.96 56.2,18.1
  Bottom 0.305: 56.2,18.1 56.83,17.46 56.83,16.83 54.93,14.92
GPOUT6  (via drill 0.6)
  Top 0.254: IC8.10 54.96,24.13 55.88,24.13 56.52,23.5 v56.52,22.54
  Bottom 0.254: JP2.17 42.86,10.48 42.86,13.02 44.13,14.29 55.24,14.29 | 56.52,21.91 v56.52,22.54
  Bottom 0.305: 56.52,21.91 56.52,21.59 57.47,20.64 57.47,16.51 55.24,14.29
GPOUT7  (via drill 0.6)
  Top 0.254: 56.63,24.65 IC8.11
  Top 0.305: v58.1,21.91 58.1,23.18 56.63,24.65
  Bottom 0.254: JP2.19 45.4,10.48 45.4,12.38 46.67,13.65 55.56,13.65
  Bottom 0.305: 55.56,13.65 58.1,16.19 v58.1,21.91
IND0  (via drill 0.6)
  Top 0.254: v17.14,34.61 IC4.3 | v17.14,24.13 14.29,24.13 13.02,25.4 P2.C
  Bottom 0.254: CN1.C 7.73,21.07 P2.C | v17.14,24.13 v17.14,34.61
IND1  (via drill 0.6)
  Top 0.254: v21.27,33.02 IC4.4 | v19.69,26.67 14.29,26.67 13.02,27.94 P2.D
  Bottom 0.254: CN1.D 9.15,25.03 P2.D | v21.27,33.02 21.27,31.43 20.32,30.48 20.32,28.57 19.69,27.94 v19.69,26.67
IND2  (via drill 0.6)
  Top 0.254: P2.E 13.02,30.48 14.29,29.21 v19.37,28.89 | v20.32,31.75 20.64,32.07 IC4.5
  Bottom 0.254: CN1.E 10.57,28.99 P2.E | v19.37,28.89 19.69,29.21 19.69,31.11 v20.32,31.75
IND3
  Top 0.254: IC4.6 20,30.8 19.05,31.75 14.29,31.75 13.02,33.02 P2.F
  Bottom 0.254: CN1.F 11.99,32.95 P2.F
IND4
  Top 0.254: P2.H 13.02,35.56 14.29,34.29 15.56,34.29 16.19,33.65 19.37,33.65 19.69,33.97 25.08,33.97 26.99,32.07 IC4.10
  Bottom 0.254: CN1.H 10.72,36.91 P2.H
IND5
  Top 0.254: P2.J 13.02,38.1 14.29,36.83 20.96,36.83 21.27,36.51 21.27,35.56 21.59,35.24 24.76,35.24 25.4,34.61 25.4,34.29 26.35,33.34 IC4.11
  Bottom 0.254: CN1.J 9.3,40.87 P2.J
IND6  (via drill 0.6)
  Top 0.254: P2.K 13.02,40.64 14.29,39.37 v26.35,39.37 | v26.67,34.61 IC4.12
  Bottom 0.254: CN1.K 7.88,44.83 P2.K | v26.35,39.37 26.35,35.56 26.67,35.24 v26.67,34.61
IND7  (via drill 0.6)
  Top 0.254: P2.L 13.02,43.18 14.29,41.91 20.96,41.91 21.59,41.28 v27.3,41.28 | v27.3,35.88 IC4.13
  Bottom 0.254: CN1.L 6.46,48.79 P2.L | v27.3,41.28 v27.3,35.88
MISO2  (via drill 0.6)
  Top 0.254: IC1.9 42.86,30.8 43.5,30.16 v44.45,30.16 | v52.71,26.99 53.02,26.99 53.66,26.67 54.92,26.67 IC8.15
  Bottom 0.254: v44.45,30.16 44.45,26.99 45.4,26.03 51.75,26.03 v52.71,26.99
MOSI  (via drill 0.6)
  Top 0.254: v32.07,33.34 IC1.4 36.51,33.34 36.83,33.65 38.74,33.65 39.05,33.97 44.45,33.97 44.77,33.65 v45.4,33.65 | IC8.16 55.41,27.15 55.88,27.62 55.88,27.94 v55.56,28.26
  Bottom 0.254: v32.07,33.34 32.07,31.75 32.39,31.43 32.39,30.48 29.53,27.62 27.94,27.62 27.62,27.31 R4.1 | v45.4,33.65 45.72,33.34 45.72,31.75 46.04,31.43 46.04,28.57 46.67,27.94 54.93,27.94 55.24,28.26 v55.56,28.26
MOTOR
  Top 0.813: C7.+ 49.4,52.9 51.75,55.25 60.01,55.25 60.32,55.56 61.28,56.83 IC6.1
  Bottom 0.813: P3.3 72.39,64.77 70.8,63.18 66.99,63.18 63.18,59.37 IC6.1 61.28,46.35 59.69,44.77 C10.1
N$1
  Top 0.254: CN1.10 6.78,48.79 11.11,44.45 12.7,44.45 13.97,43.18 P2.10
N$2
  Top 0.254: CN1.11 6.63,52.75 9.84,49.53 9.84,48.26 11.11,46.99 13.33,46.99 P2.11
N$3
  Top 0.254: IC8.20 51.68,30.41 52.39,31.11 56.52,31.11
  Top 0.305: 56.52,31.11 56.83,31.11 59.69,28.26 64.14,28.26 R3.1
N$4
  Top 0.254: IC8.21 51.18,30.55 52.39,31.75
  Top 0.305: R2.1 60.96,32.07 58.74,32.07 58.42,31.75 52.39,31.75
N$5  (via drill 0.6)
  Top 0.61: CN1.2 6.63,17.11 9.84,20.32 9.84,22.86 11.11,24.13 13.33,24.13 P2.2 v24.76,22.86 | v23.18,49.85 SJ7.2
  Bottom 0.61: v24.76,22.86 24.76,26.67 26.35,28.26 26.35,32.07 25.4,33.02 25.4,38.42 25.08,38.74 25.08,40.32 25.4,40.64 25.4,45.09 23.18,47.31 v23.18,49.85
N$6
  Top 0.254: CN1.8 9.3,40.87 10.8,39.37 13.33,39.37 P2.8
N$7
  Top 0.254: CN1.9 7.88,44.83 10.8,41.91 13.33,41.91 P2.9
N$8
  Top 0.813: C13.1 55.88,48.58 56.52,49.21 59.25,49.21 | 59.25,49.21 C12.+ | 59.25,49.21 59.37,49.21 61.28,47.31 61.28,34.29 61.91,33.65 JP3.1
  Bottom 0.813: IC6.3 59.06,64.45 57.78,63.18 57.78,50.93 C12.+
N$11  (via drill 0.6)
  Top 0.254: IC8.25 46.19,27.15 46.04,27.31 46.04,28.89 v48.26,31.43
  Bottom 0.254: v48.26,31.43 48.26,32.07 50.48,34.29 50.48,35.75 Q1.2 50.61,36.64 53.97,40 C3.1
N$16
  Bottom 0.813: USB2.GND@2 USB2.GND@1 C18.1 61.28,9.53 R6.2
N$37  (via drill 0.6)
  Top 0.254: IC4.2 25.4,35.88 26.03,36.51 26.67,36.51 26.99,36.83 27.62,36.83 27.94,36.51 v31.43,36.51 | v31.43,30.8 IC4.9 | v30.48,40.96 38.42,40.96 39.05,41.59 41.91,41.59 42.86,42.54 48.58,42.54
  Top 0.305: 48.58,42.54 49.53,43.5 R19.2
  Bottom 0.254: v31.43,30.8 31.43,31.11 31.12,31.43 31.12,35.24 31.43,35.56 v31.43,36.51 30.48,37.46 v30.48,40.96
PETCLK  (via drill 0.6)
  Top 0.254: CN1.6 9.45,32.95 10.8,34.29 13.33,34.29 P2.6 v20,33.02 | v33.02,66.36 SJ4.1 | v20,47.94 v33.02,47.94
  Bottom 0.254: v33.02,66.36 33.02,65.09 32.7,64.77 32.7,60.01 32.39,59.69 32.39,55.88 33.02,55.25 v33.02,47.94 | v20,33.02 v20,47.94
PETVICDATA/C64SEL  (via drill 0.6)
  Top 0.254: v16.19,49.85 SJ9.2 | v19.05,60.32 SJ3.1
  Bottom 0.254: CN1.M 7.58,52.75 9.84,50.48 9.84,47.94 P2.M 13.33,46.99 15.24,46.99 16.19,47.94 v16.19,49.85 16.19,57.47 v19.05,60.32
SCLK  (via drill 0.6)
  Top 0.254: IC1.6 v36.51,30.8 37.78,32.7 43.5,32.7 v43.82,32.39 | IC8.13 52.64,25.65 v52.39,25.4
  Bottom 0.254: v36.51,30.8 35.56,30.8 32.39,27.62 31.43,27.62 30.48,26.67 R5.1 | v52.39,25.4 44.45,25.4 43.5,26.35 43.5,31.43 43.82,31.75 v43.82,32.39
SPICLK  (via drill 0.6)
  Top 0.254: SJ1.1 16.19,67.31 17.14,68.26 36.83,68.26 37.15,68.58 38.74,68.58 39.05,68.26 v39.69,68.26 | v39.05,63.82 SJ4.2 | IC4.8 31.43,29.53 32.39,30.48 32.39,31.75 32.7,32.07 IC1.5 36.2,32.07 v36.51,32.39 | v39.05,60.32 SJ12.1 | v35.56,48.9 v39.05,48.9
  Bottom 0.254: v39.69,68.26 39.69,67.63 39.05,66.99 v39.05,63.82 v39.05,60.32 v39.05,48.9 | v36.51,32.39 34.92,33.97 34.92,42.23 35.56,42.86 v35.56,48.9
SPIMISO  (via drill 0.6)
  Top 0.254: IC4.1 26.03,37.15 27.94,39.37 32.07,39.37 32.7,38.74 33.34,38.74 33.97,38.1 v38.42,38.1 | v38.42,29.53 IC1.8 | v39.05,26.35 R9.2
  Bottom 0.254: v38.42,38.1 38.42,35.88 37.15,34.61 39.05,32.7 39.05,30.48 38.42,29.85 v38.42,29.53 38.42,27.62 39.05,26.99 v39.05,26.35
SPIMOSI  (via drill 0.6)
  Top 0.254: SJ2.1 17.78,60.32 20.32,57.79 SJ3.2 v25.72,57.79 | v32.07,34.61 IC1.3
  Bottom 0.254: v32.07,34.61 32.07,35.24 32.39,35.56 32.39,36.83 31.43,37.78 31.43,45.09 30.16,46.35 27.62,46.35 26.35,47.63 26.35,56.2 25.72,56.83 v25.72,57.79
TAPEREAD
  Top 0.305: SJ10.1 37.15,54.29 42.54,59.69 42.54,66.36 43.82,67.63 73.98,67.63 74.93,66.68 P3.4
TAPESENSE
  Top 0.254: SJ6.1 31.75,66.36 32.07,66.04 32.07,63.82 33.65,62.23
  Top 0.305: 33.65,62.23 40.64,62.23 41.91,63.5 41.91,66.99 43.18,68.26 78.74,68.26 80.01,66.99 P3.6
USB5V  (via drill 0.6)
  Top 0.813: v68.9,17.46 68.9,28.89 67.95,29.85 67.95,33.97 65.72,36.2 JP3.2
  Bottom 0.813: USB1.VBUS v68.9,17.46
USBGND
  Top 0.305: X1.GND 74.96,6 74.29,6.67 74.29,9.53 73.66,10.16 71.12,10.16 | USB2.GND 71.13,10.15 71.12,10.16 | R7.2 69.53,11.75 71.12,10.16
VBCOMP  (via drill 0.6)
  Top 0.254: IC8.22 50.68,30.68 52.39,32.39
  Top 0.305: 52.39,32.39 57.78,32.39 58.1,32.39 58.74,33.02 v59.69,33.02 | X1.VBUS 76.49,8.6 75.56,9.53 75.56,10.16 73.98,11.75 72.71,11.75 71.12,13.33 65.09,13.33 | 65.09,13.33 v60.96,13.33 | USB2.VBUS 66.34,8.59 65.09,9.84 65.09,13.33
  Bottom 0.305: v59.69,33.02 60.64,32.07 60.64,21.91 C19.1 60.01,17.78 61.6,16.19 61.6,15.24 60.96,14.6 v60.96,13.33
VCC  (via drill 0.6)
  Top 0.254: 29.53,37.25 IC4.14 | v42.54,38.42 42.54,37.78
  Top 0.406: v28.26,38.42 29.53,38.42 29.53,37.25 | 42.54,37.78 41.91,37.15 IC1.14
  Top 0.61: C2.1 31.75,42.86 33.02,41.59 37.78,41.59 C4.1 | v25.4,54.29 SJ7.1
  Top 0.813: P3.2 69.85,60.32 C35.+ 72.07,58.42 74.93,55.56 76.52,54.29 TO1.B | C4.1 40.64,42.86 R19.1
  Bottom 0.254: 28.26,41.91 28.1,42.07 | JP2.1 21.59,9.21 | C2.1
  Bottom 0.406: 28.26,41.91 v28.26,38.42 28.26,29.21 25.72,26.67 25.72,24.45 26.99,23.5 26.99,20.64 | 42.54,37.15 v42.54,38.42
  Bottom 0.61: C2.1 28.1,42.07 26.67,43.5 26.67,45.72 25.4,46.99 v25.4,54.29 | v42.54,38.42 42.54,39.37 | 42.54,39.37 C4.1 | 42.54,37.15 42.23,36.83 42.23,26.03 40.64,24.45 R9.1 R8.1 35.56,20.64 26.99,20.64 26.35,20.64 25.08,19.37 25.08,17.14 22.54,14.6 22.54,10.16 21.59,9.21 | C9.+ 16.51,9.21 JP2.1 | 42.54,39.37 42.54,40 43.5,40.96 C8.1 48.26,40.96 50.17,42.86 64.14,42.86
  Bottom 0.813: C5.1 80.65,49.21 78.74,51.12 TO1.B 76.52,48.58 75.56,47.63 71.44,47.63 69.21,45.4 65.4,45.4 64.14,44.13 64.14,42.86 JP3.3

### Text on the board
Top: 1 | CBM-USB-V1.1A | (C) A. Fachat
tPlace: 1 | PET | C64 | VIC20 | CBM-USB-V1.1A | (C) A. Fachat